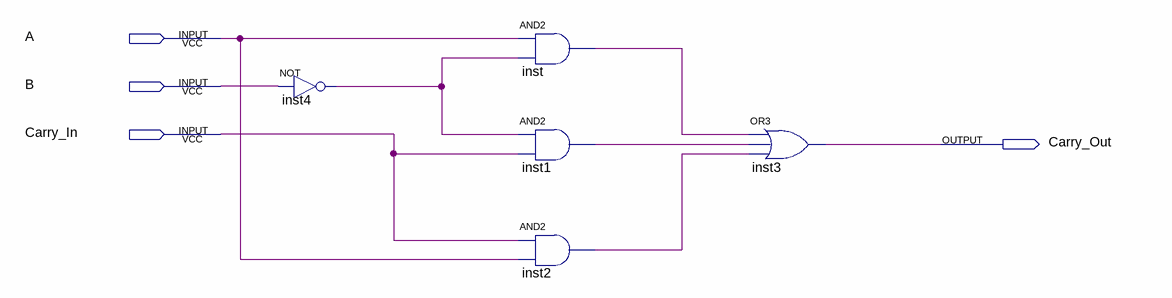
[diagram p0: schematic sheet]
// Quartus schematic MaiorQ1Bit.bdf as structural Verilog: 5 symbols, 4 pins
module MaiorQ1Bit (
  input  A,
  input  B,
  input  Carry_In,
  output Carry_Out
);

  wire inst1_out, inst2_out, inst4_out, inst_out;

  not inst4 (inst4_out, B);
  and inst (inst_out, A, inst4_out);
  and inst1 (inst1_out, inst4_out, Carry_In);
  and inst2 (inst2_out, Carry_In, A);
  or inst3 (Carry_Out, inst_out, inst1_out, inst2_out);
endmodule
